# Altium schematic sheet Template A5.SchDoc
size 193 x 146 mm
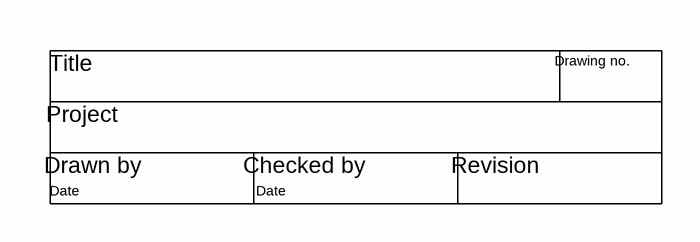
[diagram p0: Template A5.SchDoc]

## Notes on the sheet
- Title
- Project
- Drawing no.
- Date
- Drawn by
- Checked by
- Revision